# EAGLE design pca_mosfet_v3 (EAGLE 6.5.0)
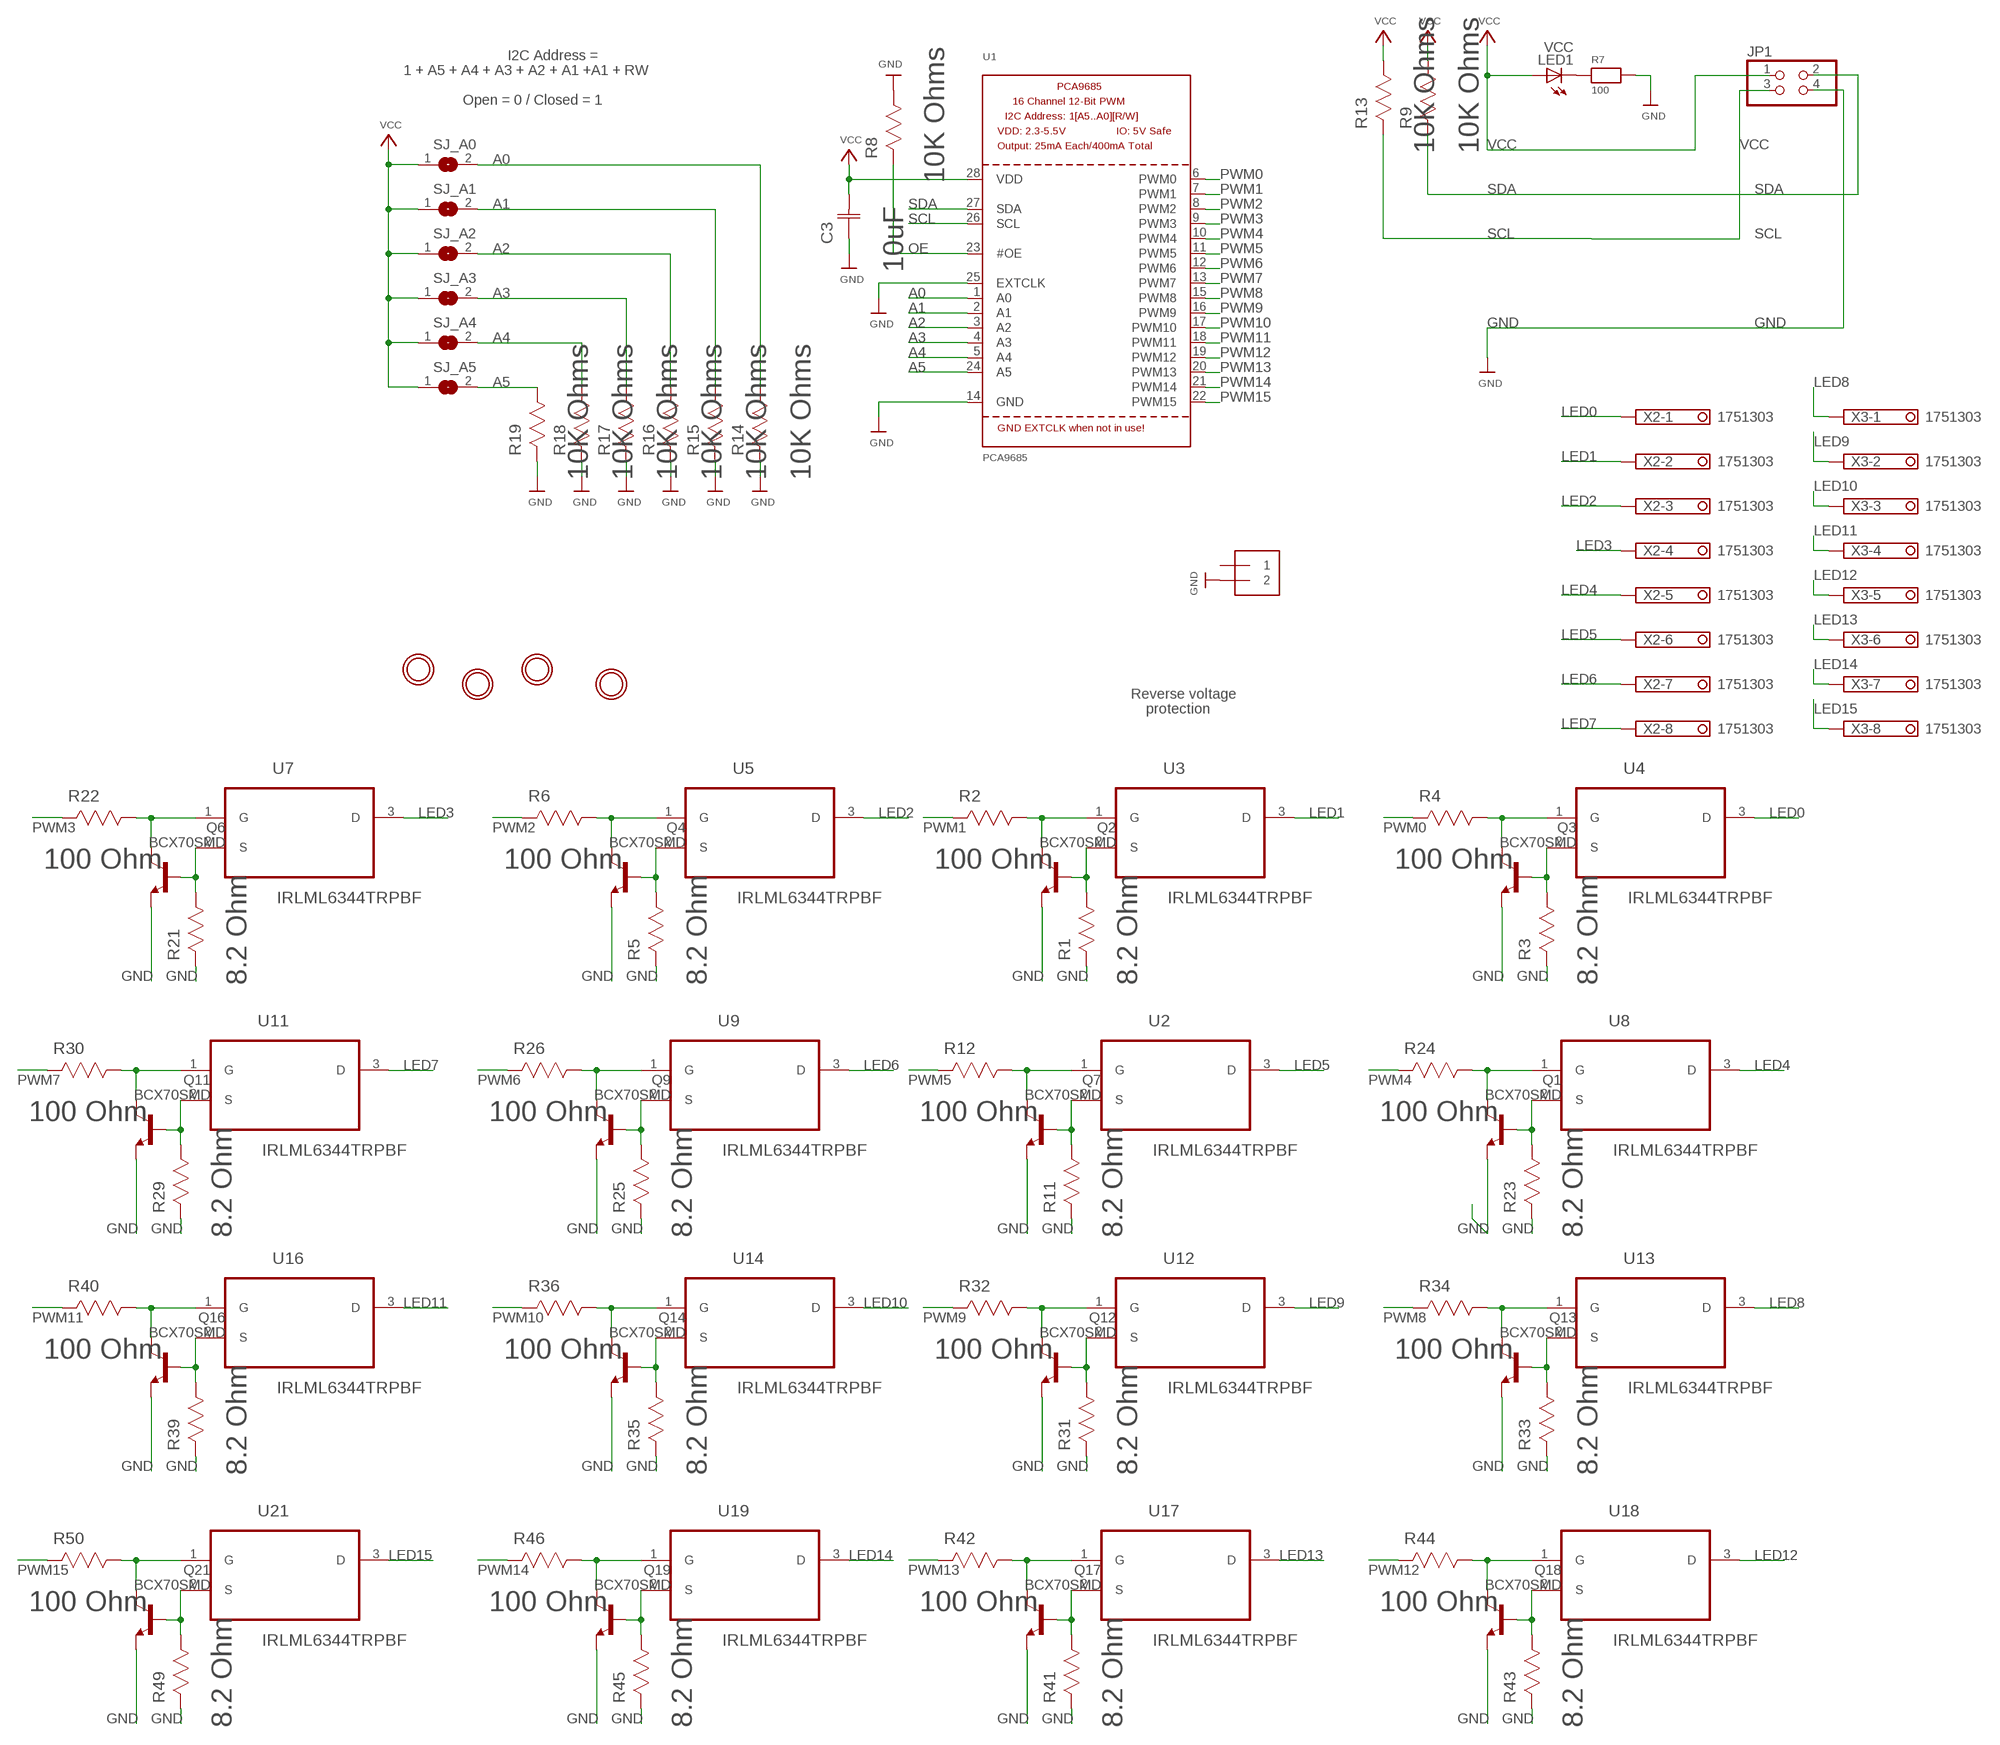
[diagram p0: schematic, sheet 1]

## Parts
C3  10uF  CC0805KKX5R6BB106  [CAPC2013X145N]
J1  TERMBLOCK_1X2-3.5MM  [1X2-3.5MM]
JP1  PINHD-2X02_MICROMATCH  [MICROMATCH-4]
LED1  VCC  LED  [SMARTLED-TTW]
Q1  BCX70SMD  [SOT23]
Q2  BCX70SMD  [SOT23]
Q3  BCX70SMD  [SOT23]
Q4  BCX70SMD  [SOT23]
Q6  BCX70SMD  [SOT23]
Q7  BCX70SMD  [SOT23]
Q9  BCX70SMD  [SOT23]
Q11  BCX70SMD  [SOT23]
Q12  BCX70SMD  [SOT23]
Q13  BCX70SMD  [SOT23]
Q14  BCX70SMD  [SOT23]
Q16  BCX70SMD  [SOT23]
Q17  BCX70SMD  [SOT23]
Q18  BCX70SMD  [SOT23]
Q19  BCX70SMD  [SOT23]
Q21  BCX70SMD  [SOT23]
R1  8.2 Ohm  ERJ-P14J8R2U  [RESC3225X71N]
R2  100 Ohm  RC1206FR-07100RL  [RESC3216X71N]
R3  8.2 Ohm  ERJ-P14J8R2U  [RESC3225X71N]
R4  100 Ohm  RC1206FR-07100RL  [RESC3216X71N]
R5  8.2 Ohm  ERJ-P14J8R2U  [RESC3225X71N]
R6  100 Ohm  RC1206FR-07100RL  [RESC3216X71N]
R7  100  RESISTOR1206  [1206]
R8  10K Ohms  RC1206JR-0710KL  [RESC3216X71N]
R9  10K Ohms  RC1206JR-0710KL  [RESC3216X71N]
R11  8.2 Ohm  ERJ-P14J8R2U  [RESC3225X71N]
R12  100 Ohm  RC1206FR-07100RL  [RESC3216X71N]
R13  10K Ohms  RC1206JR-0710KL  [RESC3216X71N]
R14  10K Ohms  RC1206JR-0710KL  [RESC3216X71N]
R15  10K Ohms  RC1206JR-0710KL  [RESC3216X71N]
R16  10K Ohms  RC1206JR-0710KL  [RESC3216X71N]
R17  10K Ohms  RC1206JR-0710KL  [RESC3216X71N]
R18  10K Ohms  RC1206JR-0710KL  [RESC3216X71N]
R19  10K Ohms  RC1206JR-0710KL  [RESC3216X71N]
R21  8.2 Ohm  ERJ-P14J8R2U  [RESC3225X71N]
R22  100 Ohm  RC1206FR-07100RL  [RESC3216X71N]
R23  8.2 Ohm  ERJ-P14J8R2U  [RESC3225X71N]
R24  100 Ohm  RC1206FR-07100RL  [RESC3216X71N]
R25  8.2 Ohm  ERJ-P14J8R2U  [RESC3225X71N]
R26  100 Ohm  RC1206FR-07100RL  [RESC3216X71N]
R29  8.2 Ohm  ERJ-P14J8R2U  [RESC3225X71N]
R30  100 Ohm  RC1206FR-07100RL  [RESC3216X71N]
R31  8.2 Ohm  ERJ-P14J8R2U  [RESC3225X71N]
R32  100 Ohm  RC1206FR-07100RL  [RESC3216X71N]
R33  8.2 Ohm  ERJ-P14J8R2U  [RESC3225X71N]
R34  100 Ohm  RC1206FR-07100RL  [RESC3216X71N]
R35  8.2 Ohm  ERJ-P14J8R2U  [RESC3225X71N]
R36  100 Ohm  RC1206FR-07100RL  [RESC3216X71N]
R39  8.2 Ohm  ERJ-P14J8R2U  [RESC3225X71N]
R40  100 Ohm  RC1206FR-07100RL  [RESC3216X71N]
R41  8.2 Ohm  ERJ-P14J8R2U  [RESC3225X71N]
R42  100 Ohm  RC1206FR-07100RL  [RESC3216X71N]
R43  8.2 Ohm  ERJ-P14J8R2U  [RESC3225X71N]
R44  100 Ohm  RC1206FR-07100RL  [RESC3216X71N]
R45  8.2 Ohm  ERJ-P14J8R2U  [RESC3225X71N]
R46  100 Ohm  RC1206FR-07100RL  [RESC3216X71N]
R49  8.2 Ohm  ERJ-P14J8R2U  [RESC3225X71N]
R50  100 Ohm  RC1206FR-07100RL  [RESC3216X71N]
SJ_A0  SOLDERJUMPERREFLOW_NOPASTE  [SOLDERJUMPER_REFLOW_NOPASTE]
SJ_A1  SOLDERJUMPERREFLOW_NOPASTE  [SOLDERJUMPER_REFLOW_NOPASTE]
SJ_A2  SOLDERJUMPERREFLOW_NOPASTE  [SOLDERJUMPER_REFLOW_NOPASTE]
SJ_A3  SOLDERJUMPERREFLOW_NOPASTE  [SOLDERJUMPER_REFLOW_NOPASTE]
SJ_A4  SOLDERJUMPERREFLOW_NOPASTE  [SOLDERJUMPER_REFLOW_NOPASTE]
SJ_A5  SOLDERJUMPERREFLOW_NOPASTE  [SOLDERJUMPER_REFLOW_NOPASTE]
U1  PCA9685  [TSSOP28]
U2  IRLML6344TRPBF  [SOT95P240X112-3N]
U3  IRLML6344TRPBF  [SOT95P240X112-3N]
U4  IRLML6344TRPBF  [SOT95P240X112-3N]
U5  IRLML6344TRPBF  [SOT95P240X112-3N]
U7  IRLML6344TRPBF  [SOT95P240X112-3N]
U8  IRLML6344TRPBF  [SOT95P240X112-3N]
U9  IRLML6344TRPBF  [SOT95P240X112-3N]
U11  IRLML6344TRPBF  [SOT95P240X112-3N]
U12  IRLML6344TRPBF  [SOT95P240X112-3N]
U13  IRLML6344TRPBF  [SOT95P240X112-3N]
U14  IRLML6344TRPBF  [SOT95P240X112-3N]
U16  IRLML6344TRPBF  [SOT95P240X112-3N]
U17  IRLML6344TRPBF  [SOT95P240X112-3N]
U18  IRLML6344TRPBF  [SOT95P240X112-3N]
U19  IRLML6344TRPBF  [SOT95P240X112-3N]
U21  IRLML6344TRPBF  [SOT95P240X112-3N]
U$1  MOUNTINGHOLE2.5  [MOUNTINGHOLE_2.5_PLATED]
U$2  MOUNTINGHOLE2.5  [MOUNTINGHOLE_2.5_PLATED]
U$3  MOUNTINGHOLE2.5  [MOUNTINGHOLE_2.5_PLATED]
U$48  MOUNTINGHOLE2.5  [MOUNTINGHOLE_2.5_PLATED]
X2  1751303  [1751303]
X3  1751303  [1751303]

## Nets
A0: R14.1(R1) SJ_A0.2 U1.1(A0)
A1: R15.1(R1) SJ_A1.2 U1.2(A1)
A2: R16.1(R1) SJ_A2.2 U1.3(A2)
A3: R17.1(R1) SJ_A3.2 U1.4(A3)
A4: R18.1(R1) SJ_A4.2 U1.5(A4)
A5: R19.1(R1) SJ_A5.2 U1.24(A5)
GND: C3.1(C1) J1.2 JP1.4 Q1.2(E) Q2.2(E) Q3.2(E) Q4.2(E) Q6.2(E) Q7.2(E) Q9.2(E) Q11.2(E) Q12.2(E) Q13.2(E) Q14.2(E) Q16.2(E) Q17.2(E) Q18.2(E) Q19.2(E) Q21.2(E) R1.2(R2) R3.2(R2) R5.2(R2) R7.2 R8.1(R1) R11.2(R2) R14.2(R2) R15.2(R2) R16.2(R2) R17.2(R2) R18.2(R2) R19.2(R2) R21.2(R2) R23.2(R2) R25.2(R2) R29.2(R2) R31.2(R2) R33.2(R2) R35.2(R2) R39.2(R2) R41.2(R2) R43.2(R2) R45.2(R2) R49.2(R2) U1.14(GND) U1.25(EXTCLK)
LED0: U4.3(D) X2.1
LED1: U3.3(D) X2.2
LED2: U5.3(D) X2.3
LED3: U7.3(D) X2.4
LED4: U8.3(D) X2.5
LED5: U2.3(D) X2.6
LED6: U9.3(D) X2.7
LED7: U11.3(D) X2.8
LED8: U13.3(D) X3.1
LED9: U12.3(D) X3.2
LED10: U14.3(D) X3.3
LED11: U16.3(D) X3.4
LED12: U18.3(D) X3.5
LED13: U17.3(D) X3.6
LED14: U19.3(D) X3.7
LED15: U21.3(D) X3.8
N$1: LED1.C@1(C) R7.1
N$2: Q7.1(B) R11.1(R1) U2.2(S)
N$3: Q2.1(B) R1.1(R1) U3.2(S)
N$4: Q2.3(C) R2.1(R1) U3.1(G)
N$5: Q7.3(C) R12.1(R1) U2.1(G)
N$6: Q3.1(B) R3.1(R1) U4.2(S)
N$7: Q3.3(C) R4.1(R1) U4.1(G)
N$8: Q4.1(B) R5.1(R1) U5.2(S)
N$9: Q4.3(C) R6.1(R1) U5.1(G)
N$12: Q6.1(B) R21.1(R1) U7.2(S)
N$13: Q6.3(C) R22.1(R1) U7.1(G)
N$14: Q1.1(B) R23.1(R1) U8.2(S)
N$15: Q1.3(C) R24.1(R1) U8.1(G)
N$16: Q9.1(B) R25.1(R1) U9.2(S)
N$17: Q9.3(C) R26.1(R1) U9.1(G)
N$20: Q11.1(B) R29.1(R1) U11.2(S)
N$21: Q11.3(C) R30.1(R1) U11.1(G)
N$22: Q12.1(B) R31.1(R1) U12.2(S)
N$23: Q12.3(C) R32.1(R1) U12.1(G)
N$24: Q13.1(B) R33.1(R1) U13.2(S)
N$25: Q13.3(C) R34.1(R1) U13.1(G)
N$26: Q14.1(B) R35.1(R1) U14.2(S)
N$27: Q14.3(C) R36.1(R1) U14.1(G)
N$30: Q16.1(B) R39.1(R1) U16.2(S)
N$31: Q16.3(C) R40.1(R1) U16.1(G)
N$32: Q17.1(B) R41.1(R1) U17.2(S)
N$33: Q17.3(C) R42.1(R1) U17.1(G)
N$34: Q18.1(B) R43.1(R1) U18.2(S)
N$35: Q18.3(C) R44.1(R1) U18.1(G)
N$36: Q19.1(B) R45.1(R1) U19.2(S)
N$37: Q19.3(C) R46.1(R1) U19.1(G)
N$40: Q21.1(B) R49.1(R1) U21.2(S)
N$41: Q21.3(C) R50.1(R1) U21.1(G)
OE: R8.2(R2) U1.23(#OE)
PWM0: R4.2(R2) U1.6(PWM0)
PWM1: R2.2(R2) U1.7(PWM1)
PWM2: R6.2(R2) U1.8(PWM2)
PWM3: R22.2(R2) U1.9(PWM3)
PWM4: R24.2(R2) U1.10(PWM4)
PWM5: R12.2(R2) U1.11(PWM5)
PWM6: R26.2(R2) U1.12(PWM6)
PWM7: R30.2(R2) U1.13(PWM7)
PWM8: R34.2(R2) U1.15(PWM8)
PWM9: R32.2(R2) U1.16(PWM9)
PWM10: R36.2(R2) U1.17(PWM10)
PWM11: R40.2(R2) U1.18(PWM11)
PWM12: R44.2(R2) U1.19(PWM12)
PWM13: R42.2(R2) U1.20(PWM13)
PWM14: R46.2(R2) U1.21(PWM14)
PWM15: R50.2(R2) U1.22(PWM15)
SCL: JP1.3 R13.2(R2) U1.26(SCL)
SDA: JP1.2 R9.2(R2) U1.27(SDA)
VCC: C3.2(C2) JP1.1 LED1.A@1(A) R9.1(R1) R13.1(R1) SJ_A0.1 SJ_A1.1 SJ_A2.1 SJ_A3.1 SJ_A4.1 SJ_A5.1 U1.28(VDD)
Unconnected: J1.1

## Notes on the sheet
- I2C Address =
- 1 + A5 + A4 + A3 + A2 + A1 +A1 + RW
- Open = 0 / Closed = 1
- Reverse voltage
- protection

## Library data of the parts
C3 = Yageo_By_element14_Batch_1:CC0805KKX5R6BB106: CAPACITOR, 0805; MPN: CC0805KKX5R6BB106; OC_FARNELL: 9402136; OC_NEWARK: 98K7062; SUPPLIER: Yageo; TOLERANCE: ±10%; VOLTAGERATING: 10V
J1 = microbuilder:TERMBLOCK_1X2: 3.5mm Terminal block http://www.ladyada.net/library/pcb/eaglelibrary.html
JP1 = pinhead-2:PINHD-2X02: PIN HEADER
LED1 = led:LED: LED OSRAM: - CHIPLED LG R971, LG N971, LY N971, LG Q971, LY Q971, LO R971, LY R971 LH N974, LH R974 LS Q976, LO Q976, LY Q976 LO Q996 - Hyper CHIPLED LW Q18S LB Q993, LB Q99A, LB R99A - SideLED LS A670, LO A670, LY A670, LG A670, LP A670 LB A673, LV A673, LT A673, LW A673 LH A674 LY A675 LS A676, LA A676, LO A676, LY A676, LW A676 LS A679, LY A679, LG A679 - Hyper Micro SIDELED® LS Y876, LA Y876, LO Y876, LY Y876 LT Y87S - SmartLED LW L88C, LW L88S LB L89C, LB L89S, LG L890 LS L89K, LO L89K, LY L89K LS L896, LA L896, LO L896, LY L896 - TOPLED LS T670, LO T670, LY T670, LG T670, LP T670 LSG T670, LSP T670, LSY T670, LOP T670, LYG T670 LG T671, LOG T671, LSG T671 LB T673, LV T673, LT T673, LW T673 LH T674 LS T676, LA T676, LO T676, LY T676, LB T676, LH T676, LSB T676, LW T676 LB T67C, LV T67C, LT T67C, LS T67K, LO T67K, LY T67K, LW E67C LS E67B, LA E67B, LO E67B, LY E67B, LB E67C, LV E67C, LT E67C LW T67C LS T679, LY T679, LG T679 LS T770, LO T770, LY T770, LG T770, LP T770 LB T773, LV T773, LT T773, LW T773 LH T774 LS E675, LA E675, LY E675, LS T675 LS T776, LA T776, LO T776, LY T776, LB T776 LHGB T686 LT T68C, LB T68C - Hyper Mini TOPLED® LB M676 - Mini TOPLED Santana® LG M470 LS M47K, LO M47K, LY M47K Source: http://www.osram.convergy.de LUXEON: - LUMILED® LXK2-PW12-R00, LXK2-PW12-S00, LXK2-PW14-U00, LXK2-PW14-V00 LXK2-PM12-R00, LXK2-PM12-S00, LXK2-PM14-U00 LXK2-PE12-Q00, LXK2-PE12-R00, LXK2-PE12-S00, LXK2-PE14-T00, LXK2-PE14-U00 LXK2-PB12-K00, LXK2-PB12-L00, LXK2-PB12-M00, LXK2-PB14-N00, LXK2-PB14-P00, LXK2-PB14-Q00 LXK2-PR12-L00, LXK2-PR12-M00, LXK2-PR14-Q00, LXK2-PR14-R00 LXK2-PD12-Q00, LXK2-PD12-R00, LXK2-PD12-S00 LXK2-PH12-R00, LXK2-PH12-S00 LXK2-PL12-P00, LXK2-PL12-Q00, LXK2-PL12-R00 Source: www.luxeon.com KINGBRIGHT: KA-3528ASYC Source: www.kingbright.com
Q1-Q4 Q6 Q7 Q9 Q11-Q14 Q16-Q19 Q21 = transistor-npn:BCX70*: NPN Transistor
R1 R3 R5 R11 R21 R23 R25 R29 R31 R33 R35 R39 R41 R43 R45 R49 = Panasonic_By_element14_Batch_1:ERJ-P14J8R2U: RESISTOR, 1210; MPN: ERJ-P14J8R2U; OC_FARNELL: 1750890; OC_NEWARK: 32R9630; SUPPLIER: Panasonic; TOLERANCE: ± 1 %; WATTAGE: 0.5 W
R2 R4 R6 R12 R22 R24 R26 R30 R32 R34 R36 R40 R42 R44 R46 R50 = Yageo_By_element14_Batch_1:RC1206FR-07100RL: RESISTOR, 1206; MPN: RC1206FR-07100RL; OC_FARNELL: 1117320; OC_NEWARK: 98K7617; SUPPLIER: Yageo; TOLERANCE: ±1%; WATTAGE: 0.25 W
R7 = microbuilder:RESISTOR: Resistors 0402 - 0402 Surface Mount Package 22 Ohm 1% 1/16W [Digikey: 311-22.0LRTR-ND] 33 Ohm 5% 1/16W 1.0K 5% 1/16W 1.5K 5% 1/16W 2.0K 1% 1/16W 10.0K 1% 1/16W [Digikey: 311-10.0KLRTR-ND] 10.0K 5% 1/16W [Digikey: RMCF0402JT10K0TR-ND] 12.1K 1% 1/16W [Digikey: 311-22.0LRTR-ND] 100.0K 5% 1/16W 0603 - 0603 Surface Mount Package 0 Ohm 1/10 Watt 1% Resistor 15 Ohm 1/10 Watt 1% Resistor 33 Ohm 1/10 Watt 1% Resistor 49.9 Ohm 1/10 Watt 1% Resistor 100 Ohm 1/10 Watt 1% Resistor 150 Ohm 1/10 Watt 1% Resistor 240 Ohm 1/10 Watt 1% Resistor 390 Ohm 1/10 Watt 1% Resistor 560 Ohm 1/10 Watt 1% Resistor 680 Ohm 1/10 Watt 1% Resistor 750 Ohm 1/10 Watt 1% Resistor 1.0K Ohm 1/10 Watt 1% Resistor 1.5K Ohm 1/10 Watt 1% Resistor 2.0K Ohm 1/10 Watt 1% Resistor 2.2K Ohm 1/10 Watt 1% Resistor 3.3K Ohm 1/10 Watt 1% Resistor 4.7K Ohm 1/10 Watt 1% Resistor 10.0K Ohm 1/10 Watt 1% Resistor 12.0K Ohm 1/10 Watt 1% Resistor 12.1K Ohm 1/10 Watt 1% Resistor 20.0K Ohm 1/10 Watt 1% Resistor 33.0K Ohm 1/10 Watt 1% Resistor 100.0K Ohm 1/10 Watt 1% Resistor 0805 - 0805 Surface Mount Package 0 Ohm 1/8 Watt 1% Resistor 33 Ohm 1/8 Watt 1% Resistor 100 Ohm 1/8 Watt 1% Resistor 150 Ohm 1/8 Watt 1% Resistor 200 Ohm 1/8 Watt 1% Resistor 240 Ohm 1/8 Watt 1% Resistor 330 Ohm 1/8 Watt 1% Resistor 390 Ohm 1/8 Watt 1% Resistor 470 Ohm 1/8 Watt 1% Resistor 1.0K Ohm 1/8 Watt 1% Resistor 1.5K Ohm 1/8 Watt 1% Resistor 2.0K Ohm 1/8 Watt 1% Resistor 4.7K Ohm 1/8 Watt 1% Resistor 5.1K Ohm 1/8 Watt 1% Resistor 5.6K Ohm 1/8 Watt 1% Resistor 10.0K Ohm 1/8 Watt 1% Resistor 22.0K Ohm 1/8 Watt 1% Resistor 33.0K Ohm 1/8 Watt 1% Resistor 100K Ohm 1/8 Watt 1% Resistor 1206 - 1206 Surface Mount Package 2012 - 2010 Surface Mount Package 0.11 Ohm 1/2 Watt 1% Resistor - Digikey: RHM.11UCT-ND
R8 R9 R13-R19 = Yageo_By_element14_Batch_1:RC1206JR-0710KL: RESISTOR, 1206; MPN: RC1206JR-0710KL; OC_FARNELL: 9240640; OC_NEWARK: 98K7572; SUPPLIER: Yageo; TOLERANCE: ±5%; WATTAGE: 1/4 W
SJ_A0 SJ_A1-SJ_A5 = microbuilder:SOLDERJUMPER: SMD Solder JUMPER Solder the two pads together to create a connection, or remove the solder to break it. REFLOW - Use this footprint for solder paste and reflow ovens. WAVE - Use this footprint for hand-soldering (larger pads). CLOSED - Has a trace between the two pads to ensure it is closed by default. The trace needs to be cut to disable the jumper, and can be closed again by creating a solder bridge between the two pads.
U1 = microbuilder:PCA9685: PCA9685 - 16 Channel 12-Bit I2C PWM Controller 5.0V tolerant 16 channel, 12-bit I2C PWM controller with 25mA per output (max. 400mA total) Digikey: 568-5931-1-ND
U2-U5 U7-U9 U11-U14 U16-U19 U21 = International_Rectifier_By_element14_Batch_1:IRLML6344TRPBF: Power MOSFET; MPN: IRLML6344TRPBF; OC_FARNELL: 1857299; OC_NEWARK: 25T5501; PACKAGE: SOT-23-3; SUPPLIER: INTERNATIONAL RECTIFIER
U$1-U$3 U$48 = microbuilder:MOUNTINGHOLE: Mounting Hole For #2 screws (0.086"/2.18mm width, 0.094"/2.4mm hole) use 2.5mm
X2 X3 = con-phoenix-350:1751303: MKDS 1/ 8-3,5 Printklemme Nennstrom: 10 A Bemessungsspannung: 160 V Raster: 3,5 mm Polzahl: 8 Montageart: Löten Anschlussart: Schraubanschluss Anschlussrichtung vom Leiter zur Platine: 0° Source: http://eshop.phoenixcontact.com .. .pdf; OC_FARNELL: unknown; OC_NEWARK: unknown

## Board
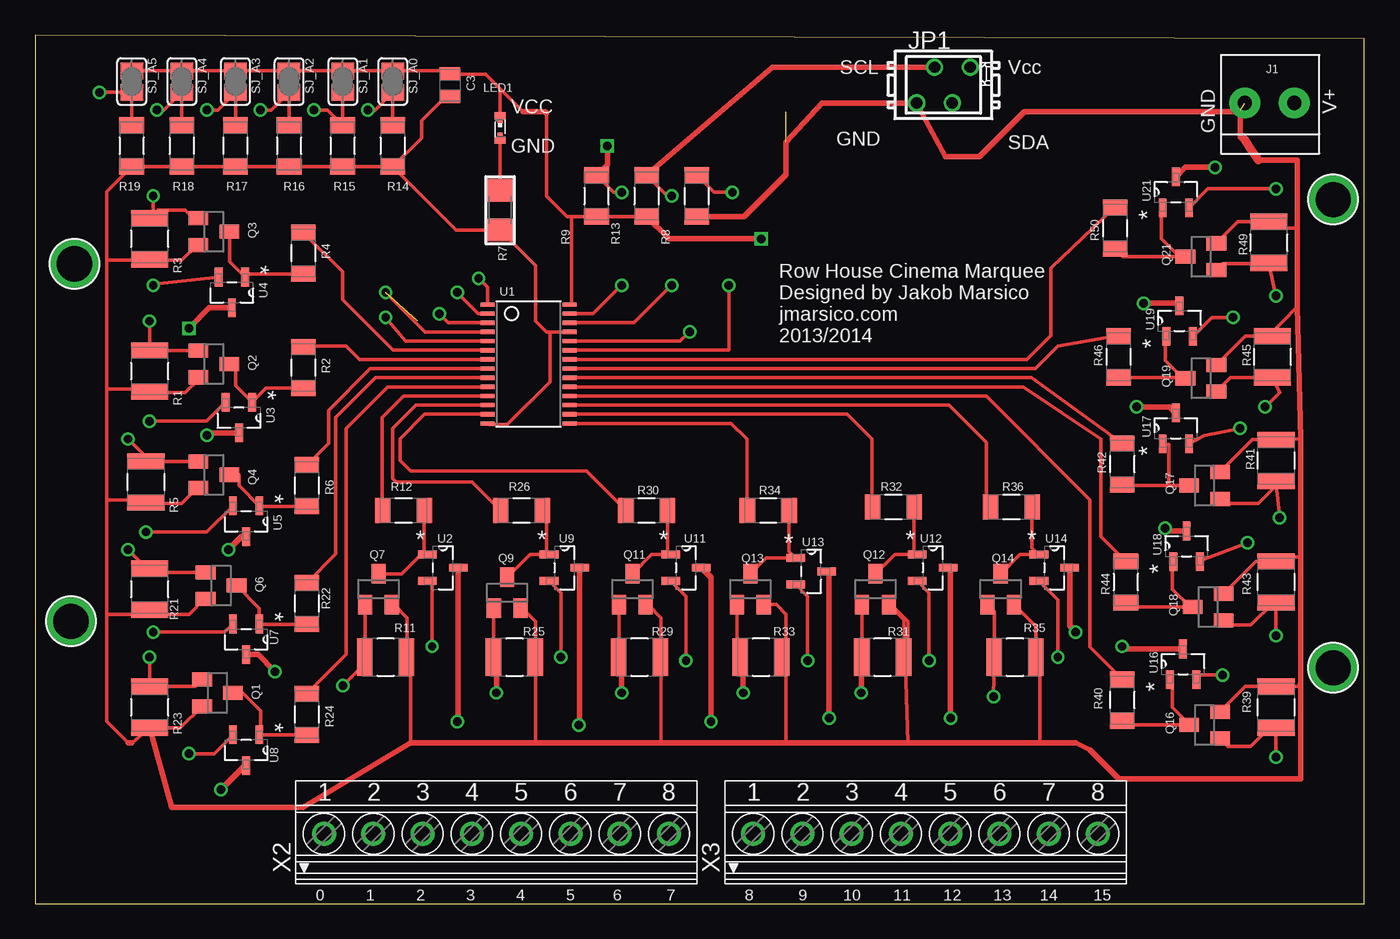
[diagram p1: board, top side]
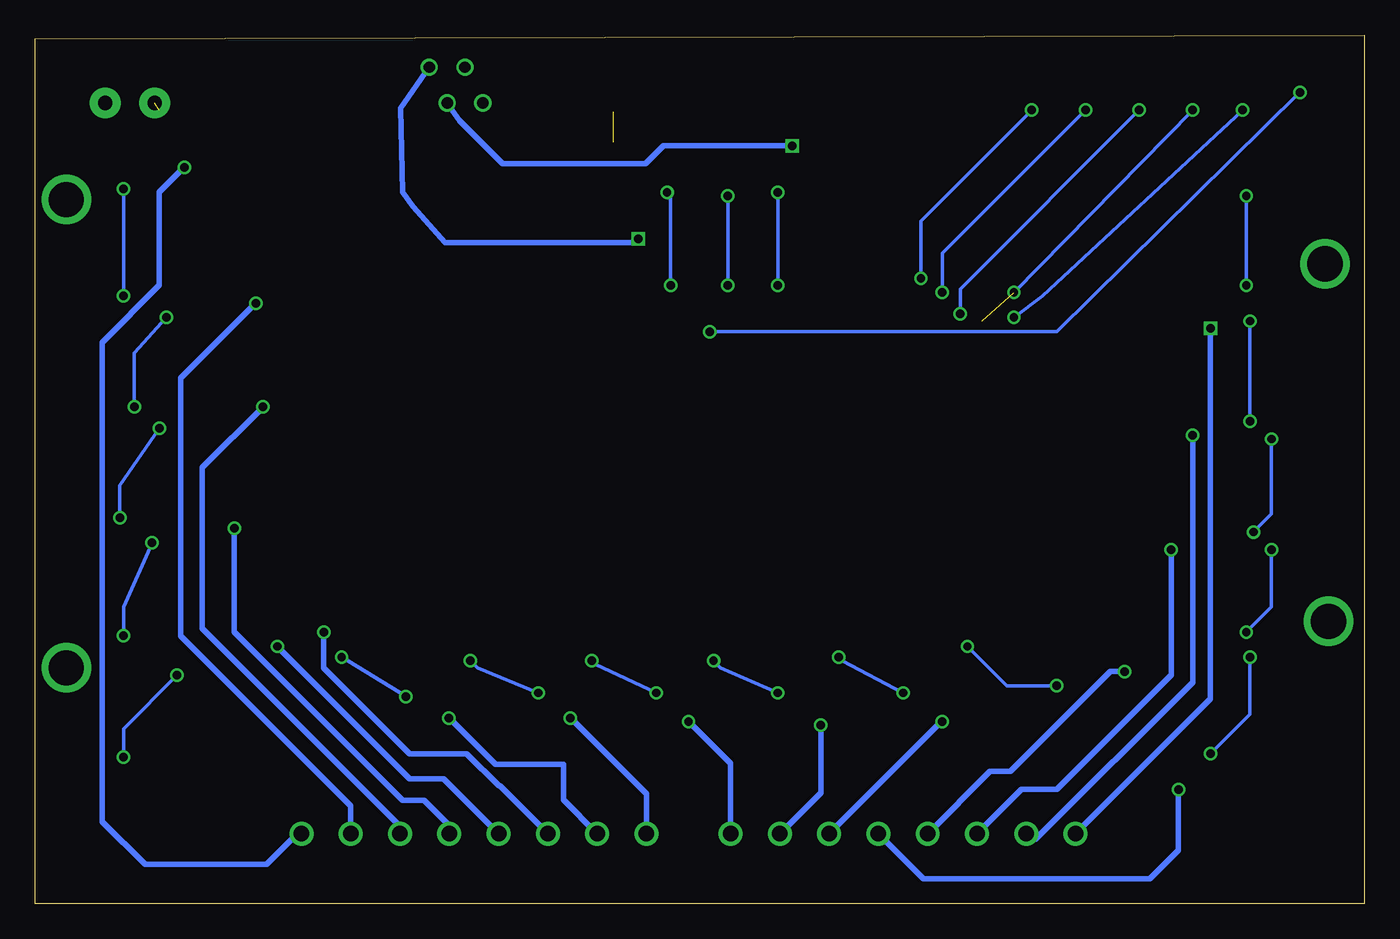
[diagram p2: board, bottom side, seen from below]

Size 94.41 x 61.71 mm. Coordinates in mm from the lower left corner, seen from the top.
Outline: 0,0 94.41,0 94.41,61.46 0,61.71 0,0
Copper layers (1*16): Top 0.0356mm / dielectric 1.5011mm / Bottom 0.0356mm
Design rules "LaenPCBOrder": minimum track width 6mil, minimum drill 13mil, track to track 6mil, track to pad 6mil, pad to pad 6mil, via to via 6mil, smd to smd 6mil, copper to edge 15mil, drill to drill 6mil, minimum pad ring 7mil, minimum via ring 7mil, stop-mask expansion 3mil, vias tented up to drill 0mil, thermal gap 10mil

### Footprints (pad centres in the part's own frame; a part is rotated, then mirrored left to right if it is on the bottom)
CAPC2013X145N = smd 0.914 x 1.448: 1 -0.813,0; 2 0.813,0
1X2-3.5MM = drill 1 pad 2.184: 1 1.8,0; 2 -1.7,0
MICROMATCH-4 = drill 0.813: 1 1.905,1.27; 2 0.635,-1.27; 3 -0.635,1.27; 4 -1.905,-1.27
SMARTLED-TTW = smd 0.8 x 0.5: A 0,-0.875; C 0,0.875 | smd 0.35 x 0.35: A@1 0,-0.5; C@1 0,0.5
SOT23 = smd 1 x 1.4: 1 -0.95,-1.1; 2 0.95,-1.1; 3 0,1.1
RESC3225X71N = smd 1.118 x 2.642: 1 -1.473,0; 2 1.473,0
RESC3216X71N = smd 1.118 x 1.753: 1 -1.473,0; 2 1.473,0
1206 = smd 1.6 x 1.8: 1 -1.4,0; 2 1.4,0
SOLDERJUMPER_REFLOW_NOPASTE = smd 1.168 x 1.6: 1 -0.762,0; 2 0.762,0
TSSOP28 = smd 0.305 x 0.991: 1 -4.225,-2.918; 2 -3.575,-2.918; 3 -2.925,-2.918; 4 -2.275,-2.918; 5 -1.625,-2.918; 6 -0.975,-2.918; 7 -0.325,-2.918; 8 0.325,-2.918; 9 0.975,-2.918; 10 1.625,-2.918; 11 2.275,-2.918; 12 2.925,-2.918; 13 3.575,-2.918; 14 4.225,-2.918; 15 4.225,2.918; 16 3.575,2.918; 17 2.925,2.918; 18 2.275,2.918; 19 1.625,2.918; 20 0.975,2.918; 21 0.325,2.918; 22 -0.325,2.918; 23 -0.975,2.918; 24 -1.625,2.918; 25 -2.275,2.918; 26 -2.925,2.918; 27 -3.575,2.918; 28 -4.225,2.918
SOT95P240X112-3N = smd 1.321 x 0.559: 1 -1.092,0.94; 2 -1.092,-0.94; 3 1.092,0
MOUNTINGHOLE_2.5_PLATED = drill 2.5 pad 3.2: P$1 0,0
1751303 = drill 1.1 pad 1.7: 1 -12.25,-0.1; 2 -8.75,-0.1; 3 -5.25,-0.1; 4 -1.75,-0.1; 5 1.75,-0.1; 6 5.25,-0.1; 7 8.75,-0.1; 8 12.25,-0.1

### Placement (x,y rotation side)
C3  29.46,58.17 90 top
J1  87.63,56.9 0 top
JP1  64.52,58.17 0 top
LED1  33.02,55.12 180 top
Q1  12.95,14.99 270 top
Q2  12.7,38.35 270 top
Q3  12.7,47.75 270 top
Q4  12.7,30.48 270 top
Q6  13.21,22.61 270 top
Q7  24.38,22.35 0 top
Q9  33.53,22.1 0 top
Q11  42.42,22.35 0 top
Q12  59.69,22.35 0 top
Q13  50.8,22.35 0 top
Q14  68.58,22.35 0 top
Q16  83.06,12.7 90 top
Q17  83.06,29.72 90 top
Q18  83.31,21.08 90 top
Q19  82.8,37.34 90 top
Q21  82.8,45.97 90 top
R1  8.13,37.85 270 top
R2  19.05,38.1 90 top
R3  8.13,47.24 270 top
R4  19.05,46.23 90 top
R5  7.87,29.97 270 top
R6  19.3,29.72 90 top
R7  33.02,49.28 270 top
R8  46.99,50.29 90 top
R9  39.88,50.29 90 top
R11  24.89,17.53 0 top
R12  26.16,27.94 180 top
R13  43.43,50.29 90 top
R14  25.4,53.85 270 top
R15  21.84,53.85 270 top
R16  18.03,53.85 270 top
R17  14.22,53.85 270 top
R18  10.41,53.85 270 top
R19  6.86,53.85 270 top
R21  8.13,22.35 270 top
R22  19.3,21.34 90 top
R23  8.13,13.97 270 top
R24  19.3,13.46 90 top
R25  34.04,17.53 0 top
R26  34.54,27.94 180 top
R29  42.93,17.53 0 top
R30  43.43,27.94 180 top
R31  60.2,17.53 0 top
R32  60.96,28.19 180 top
R33  51.56,17.53 0 top
R34  52.07,27.94 180 top
R35  69.6,17.53 0 top
R36  69.34,28.19 180 top
R39  88.14,13.97 90 top
R40  77.22,14.48 90 top
R41  88.14,31.5 90 top
R42  77.22,31.24 90 top
R43  88.14,22.86 90 top
R44  77.47,22.86 90 top
R45  87.88,38.86 90 top
R46  76.96,38.86 90 top
R49  87.63,46.99 90 top
R50  76.71,48.01 90 top
SJ_A0  25.4,58.42 270 top
SJ_A1  21.84,58.42 270 top
SJ_A2  18.03,58.42 270 top
SJ_A3  14.22,58.42 270 top
SJ_A4  10.41,58.42 270 top
SJ_A5  6.86,58.42 270 top
U1  35.05,38.35 270 top
U2  28.96,23.88 0 top
U3  14.48,34.54 270 top
U4  13.97,43.43 270 top
U5  14.99,27.18 270 top
U7  14.99,18.8 270 top
U8  14.99,10.92 270 top
U9  37.59,23.88 0 top
U11  46.23,23.88 0 top
U12  63.75,23.88 0 top
U13  55.12,23.62 0 top
U14  72.39,23.88 0 top
U16  81.53,17.02 90 top
U17  81.03,33.78 90 top
U18  81.79,25.4 90 top
U19  81.28,41.4 90 top
U21  81.03,50.55 90 top
U$1  92.2,16.76 0 top
U$2  2.79,45.47 0 top
U$3  2.54,20.07 0 top
U$48  92.2,50.04 0 top
X2  32.77,5.08 0 top
X3  63.25,5.08 0 top

### Tracks (layer width: path | path; a pad name or v marks a point on that pad's centre or on a via)
A0  (via drill 0.6)
  Top 0.254: R14.1 SJ_A0.2 24.13,56.39 v23.62,56.39 | v31.5,44.45 32.13,43.81 U1.1
  Bottom 0.254: v23.62,56.39 31.5,48.51 v31.5,44.45
A1  (via drill 0.6)
  Top 0.254: SJ_A1.2 R15.1 20.78,56.39 v19.81,56.39 | v29.97,43.43 31.48,41.93 U1.2
  Bottom 0.254: v19.81,56.39 29.97,46.23 v29.97,43.43
A2  (via drill 0.6)
  Top 0.254: R16.1 SJ_A2.2 16.76,56.39 v16,56.39 | v28.7,41.91 29.33,41.28 U1.3
  Bottom 0.254: v16,56.39 28.7,43.69 v28.7,41.91
A3  (via drill 0.6)  (1 unrouted)
  Top 0.254: R17.1 SJ_A3.2 12.95,56.39 v12.19,56.39 | v24.89,43.43 27.7,40.63 U1.4
  Bottom 0.254: v12.19,56.39 v24.89,43.43
A4  (via drill 0.6)
  Top 0.254: R18.1 SJ_A4.2 9.14,56.39 v8.64,56.39 | v24.89,41.66 26.31,39.98 U1.5
  Bottom 0.254: v8.64,56.39 22.86,43.18 v24.89,41.66
A5  (via drill 0.6)
  Top 0.254: R19.1 SJ_A5.2 v4.57,57.66 | v46.48,40.64 45.82,39.98 U1.24
  Bottom 0.254: v4.57,57.66 21.84,40.64 v46.48,40.64
GND  (2 unrouted)
  Top 0.254: 5.08,45.72 5.08,50.6 R19.2 R18.2 R17.2 R16.2 R15.2 R14.2 | 5.08,45.72 5.08,36.58 | 5.08,36.58 5.08,28.7 | 5.08,28.7 5.08,20.57 | 5.08,20.57 5.08,12.95 6.6,11.43 | 6.86,11.43 6.91,11.48 R23.2 10.32,12.5 Q1.2 | 5.08,20.57 7.82,20.57 R21.2 8.43,20.57 10.92,20.57 12,21.66 Q6.2 | 5.08,28.7 7.67,28.7 R5.2 7.93,28.45 10.41,28.45 11.5,29.53 Q4.2 | 5.08,36.58 7.93,36.58 R1.2 8.18,36.32 10.67,36.32 11.6,37.25 Q2.2 | 5.08,45.72 8.08,45.72 R3.2 8.18,45.72 10.41,45.72 11.5,46.8 Q3.2 | Q7.2 25.48,21.25 26.42,20.32 26.42,17.58 R11.2 26.67,17.22 26.67,11.43 | R25.2 35.56,17.58 | 35.56,17.58 35.56,20.07 34.63,21 Q9.2 | R29.2 44.45,17.58 | 44.45,17.58 44.45,20.32 43.52,21.25 Q11.2 | R33.2 53.34,17.83 | 53.34,17.83 53.34,20.57 52.66,21.25 Q13.2 | R31.2 61.98,17.83 61.98,20.07 60.79,21.25 Q12.2 61.72,20.17 61.98,11.43 | 35.56,17.58 35.56,11.43 | 44.45,17.58 44.45,11.43 | 53.34,17.83 53.34,11.43 | Q14.2 71.07,19.71 R35.2 71.37,17.22 71.37,11.43 | R14.2 29.9,47.88 R7.2 35.56,45.34 35.56,41.4 36.33,40.63 36.58,40.63 | 36.58,40.63 U1.25 | U1.14 32.23,34.04 33.53,34.04 36.58,37.08 36.58,40.63 | R14.2 27.43,54.41 27.43,55.63 29.16,57.35 C3.1 | Q21.2 85.44,48.46 R49.2 88.59,48.01 89.66,48.01 | Q19.2 85.95,40.34 | 85.95,40.34 R45.2 | 85.95,40.34 87.68,40.39 89.66,42.42 | 89.92,33.02 88.44,33.02 R41.2 86.46,32.97 Q17.2 | Q18.2 86.71,24.33 R43.2 88.44,24.64 89.92,24.64 | Q16.2 85.95,15.44 R39.2 89.71,15.44 89.76,15.49 89.92,16
  Top 0.406: 6.6,11.43 6.86,11.43 | R23.2 9.7,6.86 19.05,6.86 26.67,11.43 35.56,11.43 44.45,11.43 53.34,11.43 61.98,11.43 71.37,11.43 73.91,11.43 74.93,10.92 76.96,8.89 89.92,8.89 89.92,16 89.92,24.64 89.92,33.02 89.66,42.42 89.66,48.01 89.66,52.83 86.87,52.83 | 86.21,53.84 85.6,54.46 85.6,56.39 85.5,56.29 70.26,56.29 67.06,53.09 64.64,53.09 JP1.4 55.88,56.9 53.34,54.1 53.34,51.82 50.34,48.82 R8.1
  Top 0.61: 86.87,52.83 86.21,53.84 85.93,54.28
LED0  (via drill 0.6)
  Top 0.406: U4.3 12.37,42.34 v10.92,40.89
  Bottom 0.406: v10.92,40.89 10.92,14.57 X2.1
LED1  (via drill 0.6)
  Top 0.406: U3.3 12.37,33.45 v12.19,33.27
  Bottom 0.406: v12.19,33.27 12.19,15.75 23.37,4.57 23.61,4.57 X2.2
LED2  (via drill 0.6)
  Top 0.406: U5.3 14.66,26.09 v13.72,25.15
  Bottom 0.406: v13.72,25.15 13.72,16.26 21.84,8.13 24.37,8.13 X2.3
LED3  (via drill 0.6)
  Top 0.406: U7.3 15.82,17.7 v17.02,16.51
  Bottom 0.406: v17.02,16.51 18.03,16.51 25.15,9.4 26.6,9.4 X2.4
LED4  (via drill 0.6)
  Top 0.406: U8.3 14.91,9.83 v13.21,8.13
  Bottom 0.406: v13.21,8.13 13.21,3.81 15.24,1.78 31.31,1.78 X2.5
LED5  (via drill 0.6)
  Top 0.406: U2.3 30.05,13.03 v29.97,12.95
  Bottom 0.406: v29.97,12.95 30.04,12.95 X2.6
LED6  (via drill 0.6)
  Top 0.406: U9.3 38.68,12.78 v38.61,12.7
  Bottom 0.406: v38.61,12.7 38.61,7.89 X2.7
LED7  (via drill 0.6)
  Top 0.406: U11.3 48.01,23.19 v48.01,12.95
  Bottom 0.406: v48.01,12.95 45.02,9.96 X2.8
LED8  (via drill 0.6)
  Top 0.406: U13.3 56.39,23.44 v56.39,13.21
  Bottom 0.406: v56.39,13.21 51,7.82 X3.1
LED9  (via drill 0.6)
  Top 0.406: U12.3 65.02,23.7 v65.02,13.21
  Bottom 0.406: v65.02,13.21 61.72,9.91 56.9,9.91 56.9,7.38 X3.2
LED10  (via drill 0.6)
  Top 0.406: U14.3 73.48,19.74 v73.91,19.3
  Bottom 0.406: v73.91,19.3 73.91,16.76 67.82,10.67 63.75,10.67 61.47,8.38 61.4,8.38 X3.3
LED11  (via drill 0.6)
  Top 0.406: U16.3 77.39,18.11 v77.22,18.29
  Bottom 0.406: v77.22,18.29 67.82,8.89 65.41,8.89 X3.4
LED12  (via drill 0.6)
  Top 0.406: U18.3 80.44,26.49 v80.26,26.67
  Bottom 0.406: v80.26,26.67 80.26,19.3 68.33,7.37 66.8,7.37 65,5.56 X3.5
LED13  (via drill 0.6)
  Top 0.406: U17.3 80.59,35.31 v78.23,35.31
  Bottom 0.406: v78.23,35.31 82.55,30.99 82.55,19.56 68.5,5.5 X3.6
LED14  (via drill 0.6)
  Top 0.406: U19.3 81.1,42.67 v78.74,42.67
  Bottom 0.406: v78.74,42.67 84.07,37.34 84.07,19.05 72,6.97 X3.7
LED15  (via drill 0.6)
  Top 0.406: U21.3 81.71,52.32 v83.82,52.32
  Bottom 0.406: v83.82,52.32 85.6,50.55 85.6,43.94 89.66,39.88 89.66,5.84 86.61,2.79 77.98,2.79 75.79,4.98 X3.8
N$1
  Top 0.254: LED1.C@1 R7.1
N$2  (via drill 0.6)
  Top 0.254: Q7.1 23.42,21.24 R11.1 23.42,17.07 v21.84,15.49 | U2.2 28.19,22.61 v28.19,18.29
  Bottom 0.254: v28.19,18.29 25.4,15.49 v21.84,15.49
N$3  (via drill 0.6)
  Top 0.254: Q2.1 8.14,39.3 R1.1 v8.13,41.4 | U3.2 12.19,34.29 v8.13,34.29
  Bottom 0.254: v8.13,34.29 v8.13,41.4
N$4
  Top 0.254: Q2.3 14.22,38.35 14.22,36.83 U3.1 16.41,36.63 R2.1
N$5
  Top 0.254: U2.1 27.63,25.04 | 27.63,25.04 R12.1 | 27.63,25.04 26.04,23.45 Q7.3
N$6  (via drill 0.6)
  Top 0.254: v8.38,50.29 8.38,48.97 R3.1 8.69,49.28 10.67,49.28 11.6,48.34 Q3.1 | v8.38,43.94 8.46,44.02 U4.2
  Bottom 0.254: v8.38,50.29 v8.38,43.94
N$7
  Top 0.254: Q3.3 13.8,45.64 U4.1 15.14,44.76 R4.1
N$8  (via drill 0.6)
  Top 0.254: Q4.1 7.89,31.43 R5.1 7.87,31.75 v6.6,33.02 | U5.2 12.19,26.42 v7.87,26.42
  Bottom 0.254: v7.87,26.42 6.6,27.69 v6.6,33.02
N$9
  Top 0.254: Q4.3 14.48,30.48 14.48,29.72 U5.1 15.95,28.25 R6.1
N$12  (via drill 0.6)
  Top 0.254: Q6.1 8.4,23.56 R21.1 7.93,23.82 v6.6,25.15 | U7.2 13.46,19.3 v8.38,19.3
  Bottom 0.254: v8.38,19.3 6.6,21.08 v6.6,25.15
N$13
  Top 0.254: R22.1 15.95,19.86 U7.1 15.93,20.99 Q6.3
N$14  (via drill 0.6)
  Top 0.254: R23.1 8.14,15.43 | U8.2 12.7,10.67 v10.92,10.67 | v8.13,17.53 R23.1 | Q1.1 11.36,15.44 R23.1
  Bottom 0.254: v10.92,10.67 8.13,13.46 v8.13,17.53
N$15
  Top 0.254: 15.95,11.99 U8.1 15.93,12.1 | 15.95,11.99 R24.1 | 15.95,11.99 16,12.04 16,13.72 14.73,14.99 Q1.3
N$16  (via drill 0.6)
  Top 0.254: R25.1 32.58,17.54 Q9.1 | U9.2 37.34,22.1 v37.34,17.53
  Top 0.406: v32.77,14.99 32.77,17.32 R25.1
  Bottom 0.254: v37.34,17.53 37.08,17.27 v32.77,14.99
N$17
  Top 0.254: R26.1 36.02,27.74 36.32,27.43 36.32,24.99 U9.1 35.15,24.82 Q9.3
N$20  (via drill 0.6)
  Top 0.254: R29.1 41.47,17.54 Q11.1 | U11.2 46.23,21.84 v46.23,17.27
  Top 0.406: v41.66,14.99 41.66,17.32 R29.1
  Bottom 0.254: v46.23,17.27 45.72,16.76 v41.66,14.99
N$21
  Top 0.254: R30.1 44.91,25.04 U11.1 43.78,24.82 Q11.3
N$22  (via drill 0.6)
  Top 0.254: R31.1 58.67,17.58 58.67,17.78 58.74,17.85 Q12.1 | U12.2 63.5,22.1 v63.5,17.27
  Top 0.406: v58.67,14.99 58.67,17.48 R31.1
  Bottom 0.254: v63.5,17.27 62.99,16.76 v58.67,14.99
N$23
  Top 0.254: R32.1 62.43,25.04 U12.1 61.05,24.82 Q12.3
N$24  (via drill 0.6)
  Top 0.254: R33.1 49.85,17.77 Q13.1 | U13.2 54.86,21.84 v54.86,17.27
  Top 0.406: v50.29,14.99 50.29,17.32 R33.1
  Bottom 0.254: v54.86,17.27 54.61,17.02 v50.29,14.99
N$25
  Top 0.254: R34.1 53.54,25.04 U13.1 51.91,24.56 Q13.3
N$26  (via drill 0.6)
  Top 0.254: Q14.1 68.12,20.76 R35.1 v68.07,14.73 | U14.2 72.64,21.59 v72.64,17.53
  Bottom 0.254: v72.64,17.53 v68.07,14.73
N$27
  Top 0.254: Q14.3 69.94,24.82 U14.1 70.82,25.3 R36.1
N$30  (via drill 0.6)
  Top 0.254: Q16.1 84.73,11.18 86.36,11.18 87.68,12.5 R39.1 v88.14,10.41 | U16.2 82.8,16.26 v84.33,16.26
  Bottom 0.254: v84.33,16.26 88.14,12.45 v88.14,10.41
N$31
  Top 0.254: R40.1 77.52,12.7 Q16.3 81.96,12.78 80.77,13.97 80.77,15.75 U16.1
N$32  (via drill 0.6)
  Top 0.254: Q17.1 84.48,28.45 86.87,28.45 88.39,29.97 R41.1 v88.39,27.43 | U17.2 83.06,33.27 v85.6,33.78
  Bottom 0.254: v85.6,33.78 88.39,29.72 v88.39,27.43
N$33
  Top 0.254: R42.1 77.27,29.72 80.52,29.72 | 80.52,29.72 Q17.3 | U17.1 80.52,32.61 80.52,29.72
N$34  (via drill 0.6)
  Top 0.254: Q18.1 84.73,19.81 86.36,19.81 87.94,21.39 R43.1 v88.14,19.05 | U18.2 82.8,24.38 v86.11,25.65
  Bottom 0.254: v86.11,25.65 88.14,21.08 v88.14,19.05
N$35
  Top 0.254: R44.1 77.78,21.08 Q18.3 82.04,21.08 80.77,22.35 80.77,24.23 U18.1
N$36  (via drill 0.6)
  Top 0.254: Q19.1 84.91,37.39 R45.1 88.39,36.32 v87.38,35.31 | U19.2 83.57,41.66 v85.09,41.66
  Bottom 0.254: v85.09,41.66 87.38,39.12 v87.38,35.31
N$37
  Top 0.254: R46.1 81.65,37.39 Q19.3 81.53,37.34 80.26,38.61 80.26,40.23 U19.1
N$40  (via drill 0.6)
  Top 0.254: Q21.1 84.35,45.47 88.65,45.47 88.59,45.52 R49.1 v88.14,43.18 | U21.2 83.31,50.8 v88.14,50.8
  Bottom 0.254: v88.14,50.8 v88.14,43.18
N$41
  Top 0.254: U21.1 80.01,49.38 80.01,47.24 81.28,45.97 Q21.3 77.27,45.97 R50.1
OE  (via drill 0.6)
  Top 0.254: 46.93,51.82 R8.2 48.21,50.55 v49.53,50.55 | v49.28,43.94 49.28,39.37 49.23,39.33 U1.23
  Bottom 0.254: v49.53,50.55 49.28,50.29 v49.28,43.94
PWM0
  Top 0.254: R4.2 21.84,44.91 21.84,42.93 25.44,39.33 U1.6
PWM1
  Top 0.254: R2.2 19.1,39.62 22.1,39.62 23.04,38.68 U1.7
PWM2
  Top 0.254: R6.2 20.83,32.72 20.83,35.05 23.8,38.03 U1.8
PWM3
  Top 0.254: R22.2 21.34,24.84 21.34,34.54 24.17,37.38 U1.9
PWM4
  Top 0.254: R24.2 22.1,17.73 22.1,33.78 25.04,36.73 U1.10
PWM5
  Top 0.254: R12.2 24.64,27.99 24.64,34.54 26.17,36.08 U1.11
PWM6
  Top 0.254: R26.2 31.04,29.97 25.65,29.97 25.4,30.23 25.4,33.78 27.05,35.43 U1.12
PWM7
  Top 0.254: R30.2 39.17,30.73 26.67,30.73 25.91,31.5 25.91,33.02 27.67,34.78 U1.13
PWM8
  Top 0.254: R34.2 50.55,27.99 50.55,33.02 49.44,34.13 U1.15
PWM9
  Top 0.254: R32.2 59.44,28.25 59.44,33.02 57.68,34.78 U1.16
PWM10
  Top 0.254: R36.2 67.56,28.5 67.56,32.77 64.9,35.43 U1.17
PWM11
  Top 0.254: R40.2 74.93,18.24 74.93,28.7 67.55,36.08 U1.18
PWM12
  Top 0.254: R44.2 75.69,26.11 75.69,33.02 70.21,36.73 U1.19
PWM13
  Top 0.254: R42.2 70.77,37.38 U1.20
PWM14
  Top 0.254: R46.2 76.91,40.39 72.64,39.62 71.05,38.03 U1.21
PWM15
  Top 0.254: R50.2 72.14,45.16 72.14,40.39 70.43,38.68 U1.22
SCL  (via drill 0.6)
  Top 0.254: R13.2 44.91,50.29 v45.21,50.29 | v45.21,43.94 42.55,41.28 U1.26
  Top 0.406: JP1.3 52.38,59.44 R13.2
  Bottom 0.254: v45.21,50.29 v45.21,43.94
SDA  (via drill 0.6)
  Top 0.254: 39.93,51.87 39.88,51.82 R9.2 41.1,50.55 v41.66,50.55 | v41.66,43.94 39.64,41.93 U1.27
  Top 0.406: v40.64,53.85 40.64,52.53 R9.2
  Bottom 0.254: v41.66,50.55 v41.66,43.94
  Bottom 0.406: JP1.2 64.26,55.63 61.21,52.58 51.05,52.58 49.78,53.85 v40.64,53.85
VCC  (via drill 0.6)
  Top 0.254: SJ_A5.1 SJ_A4.1 SJ_A3.1 SJ_A2.1 SJ_A1.1 SJ_A0.1 29.26,59.18 C3.2 29.51,58.93 32,58.93 33.02,57.91 | 33.02,57.91 34.64,56.29 | 36.32,56.18 36.32,50.29 37.8,48.82 38.1,48.82 | 38.1,48.82 R9.1 R13.1 | LED1.A@1 33.02,57.91 | U1.28 38.1,42.71 38.1,48.82
  Top 0.406: v51.56,47.24 45.01,47.24 R13.1 | 34.64,56.29 36.21,56.29 36.32,56.18
  Bottom 0.406: JP1.1 68.45,56.52 68.33,50.55 67.56,49.53 65.28,46.99 51.82,46.99 v51.56,47.24

### Text on the board
tNames: SCL | Vcc | GND | VCC | V+ | GND | SDA | GND | Row House Cinema Marquee / Designed by Jakob Marsico / jmarsico.com / 2013/2014 | 0 | 1 | 2 | 3 | 4 | 5 | 6 | 7 | 8 | 9 | 10 | 11 | 12 | 13 | 14 | 15